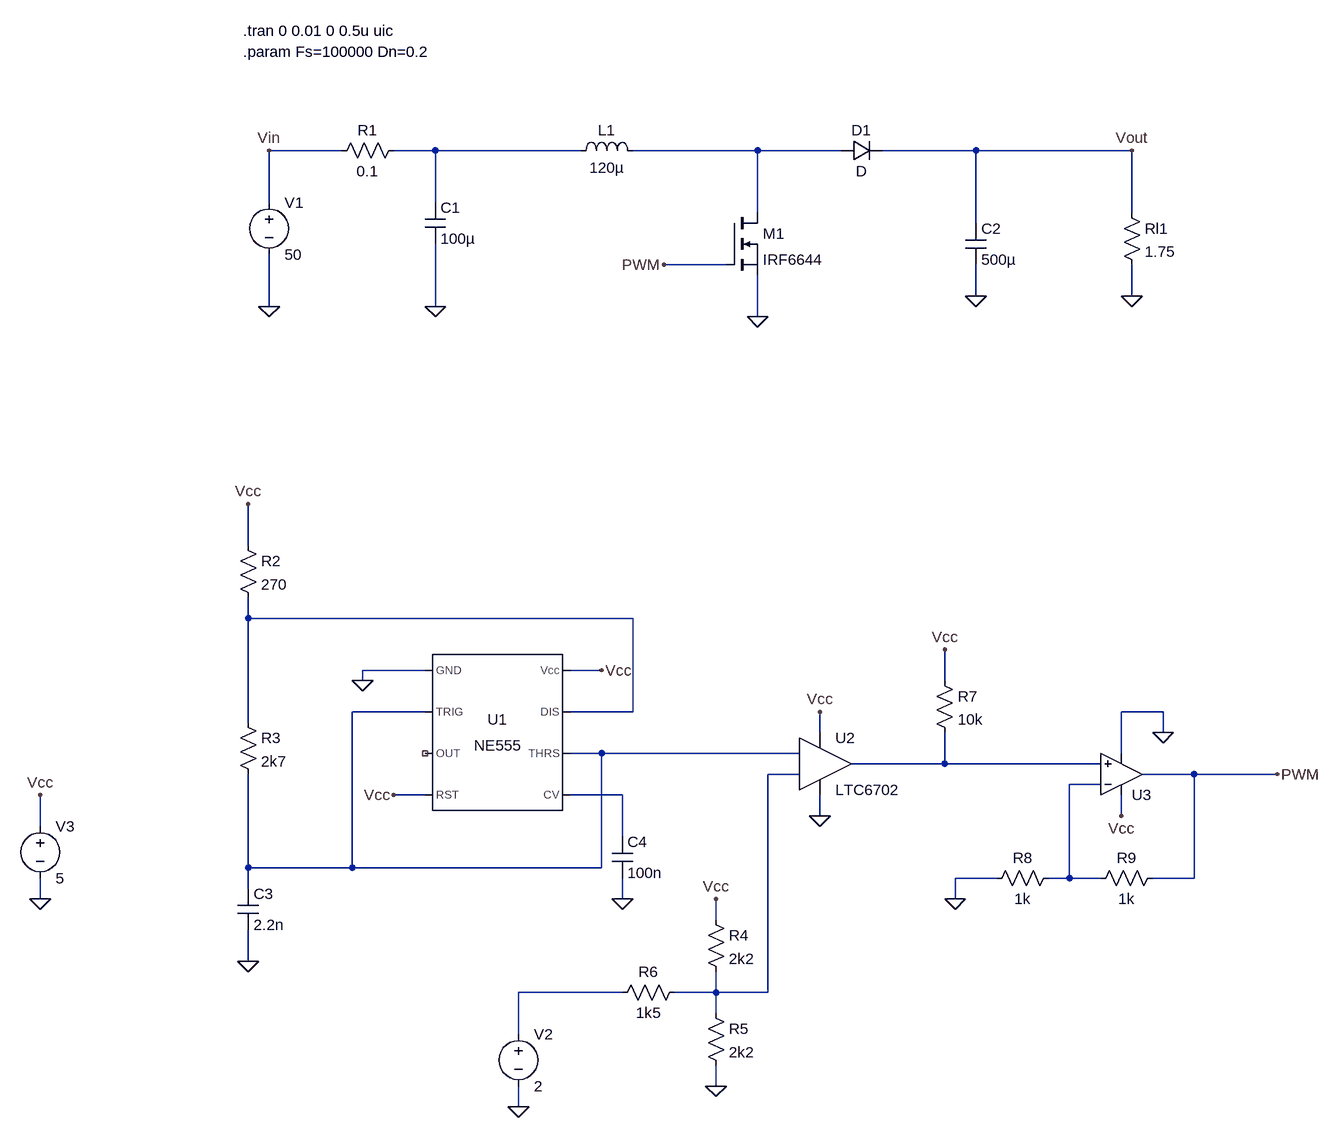
[diagram p0: schematic Completo.asc]
Completo.asc, the LTspice schematic file:
Version 4
SHEET 1 1400 1728
WIRE -304 -80 -416 -80
WIRE -160 -80 -224 -80
WIRE 64 -80 -160 -80
WIRE 336 -80 144 -80
WIRE 464 -80 336 -80
WIRE 672 -80 528 -80
WIRE 912 -80 672 -80
WIRE -416 0 -416 -80
WIRE -160 0 -160 -80
WIRE 336 16 336 -80
WIRE 912 16 912 -80
WIRE 672 32 672 -80
WIRE 288 96 192 96
WIRE 672 144 672 96
WIRE 912 144 912 96
WIRE -416 160 -416 80
WIRE -160 160 -160 64
WIRE 336 176 336 112
WIRE -448 528 -448 464
WIRE -448 640 -448 608
WIRE 144 640 -448 640
WIRE -176 720 -272 720
WIRE 96 720 48 720
WIRE -272 736 -272 720
WIRE 624 736 624 688
WIRE -176 784 -288 784
WIRE 144 784 144 640
WIRE 144 784 48 784
WIRE 960 784 896 784
WIRE -448 800 -448 640
WIRE 432 816 432 784
WIRE 960 816 960 784
WIRE 96 848 48 848
WIRE 400 848 96 848
WIRE 896 848 896 784
WIRE 624 864 624 816
WIRE 624 864 480 864
WIRE 864 864 624 864
WIRE 400 880 352 880
WIRE 1008 880 928 880
WIRE 1136 880 1008 880
WIRE 864 896 816 896
WIRE -176 912 -224 912
WIRE 128 912 48 912
WIRE 432 944 432 912
WIRE 896 944 896 912
WIRE -768 960 -768 912
WIRE 128 976 128 912
WIRE -448 1024 -448 880
WIRE -288 1024 -288 784
WIRE -288 1024 -448 1024
WIRE 96 1024 96 848
WIRE 96 1024 -288 1024
WIRE 704 1040 640 1040
WIRE 816 1040 816 896
WIRE 816 1040 784 1040
WIRE 864 1040 816 1040
WIRE 1008 1040 1008 880
WIRE 1008 1040 944 1040
WIRE -448 1056 -448 1024
WIRE -768 1072 -768 1040
WIRE 128 1072 128 1040
WIRE 640 1072 640 1040
WIRE 272 1104 272 1072
WIRE -448 1168 -448 1120
WIRE 128 1216 -32 1216
WIRE 272 1216 272 1184
WIRE 272 1216 208 1216
WIRE 352 1216 352 880
WIRE 352 1216 272 1216
WIRE 272 1248 272 1216
WIRE -32 1280 -32 1216
WIRE 272 1360 272 1328
WIRE -32 1392 -32 1360
FLAG -416 160 0
FLAG -160 160 0
FLAG 336 176 0
FLAG 672 144 0
FLAG 912 144 0
FLAG 912 -80 Vout
FLAG -416 -80 Vin
FLAG -448 1168 0
FLAG -272 736 0
FLAG 128 1072 0
FLAG -448 464 Vcc
FLAG 96 720 Vcc
FLAG -224 912 Vcc
FLAG 432 944 0
FLAG 432 784 Vcc
FLAG -32 1392 0
FLAG 624 688 Vcc
FLAG 1136 880 PWM
FLAG 272 1360 0
FLAG 272 1072 Vcc
FLAG -768 1072 0
FLAG -768 912 Vcc
FLAG 640 1072 0
FLAG 960 816 0
FLAG 896 944 Vcc
FLAG 192 96 PWM
SYMBOL cap -176 0 R0
SYMATTR InstName C1
SYMATTR Value 100µ
SYMBOL cap 656 32 R0
SYMATTR InstName C2
SYMATTR Value 500µ
SYMBOL ind 48 -64 R270
WINDOW 0 32 56 VTop 2
WINDOW 3 5 56 VBottom 2
SYMATTR InstName L1
SYMATTR Value 120µ
SYMATTR SpiceLine Ipk=67
SYMBOL res 896 0 R0
SYMATTR InstName Rl1
SYMATTR Value 1.75
SYMBOL res -208 -96 R90
WINDOW 0 0 56 VBottom 2
WINDOW 3 32 56 VTop 2
SYMATTR InstName R1
SYMATTR Value 0.1
SYMBOL voltage -416 -16 R0
WINDOW 123 0 0 Left 0
WINDOW 39 0 0 Left 0
SYMATTR InstName V1
SYMATTR Value 50
SYMBOL nmos 288 16 R0
SYMATTR InstName M1
SYMATTR Value IRF6644
SYMBOL diode 464 -64 R270
WINDOW 0 32 32 VTop 2
WINDOW 3 0 32 VBottom 2
SYMATTR InstName D1
SYMBOL Misc\\NE555 -64 816 R0
SYMATTR InstName U1
SYMBOL res -464 512 R0
SYMATTR InstName R2
SYMATTR Value 270
SYMBOL res -464 784 R0
SYMATTR InstName R3
SYMATTR Value 2k7
SYMBOL cap -464 1056 R0
SYMATTR InstName C3
SYMATTR Value 2.2n
SYMBOL cap 112 976 R0
SYMATTR InstName C4
SYMATTR Value 100n
SYMBOL res 256 1088 R0
SYMATTR InstName R4
SYMATTR Value 2k2
SYMBOL res 256 1232 R0
SYMATTR InstName R5
SYMATTR Value 2k2
SYMBOL res 224 1200 R90
WINDOW 0 0 56 VBottom 2
WINDOW 3 32 56 VTop 2
SYMATTR InstName R6
SYMATTR Value 1k5
SYMBOL voltage -32 1264 R0
WINDOW 123 0 0 Left 0
WINDOW 39 0 0 Left 0
SYMATTR InstName V2
SYMATTR Value 2
SYMBOL res 608 720 R0
SYMATTR InstName R7
SYMATTR Value 10k
SYMBOL voltage -768 944 R0
WINDOW 123 0 0 Left 0
WINDOW 39 0 0 Left 0
SYMATTR InstName V3
SYMATTR Value 5
SYMBOL Comparators\\LTC6702 432 864 R0
SYMATTR InstName U2
SYMBOL OpAmps\\UniversalOpAmp 896 880 M180
SYMATTR InstName U3
SYMBOL res 800 1024 R90
WINDOW 0 0 56 VBottom 2
WINDOW 3 32 56 VTop 2
SYMATTR InstName R8
SYMATTR Value 1k
SYMBOL res 960 1024 R90
WINDOW 0 0 56 VBottom 2
WINDOW 3 32 56 VTop 2
SYMATTR InstName R9
SYMATTR Value 1k
TEXT -456 -264 Left 2 !.tran 0 0.01 0 0.5u uic
TEXT -456 -232 Left 2 !.param Fs=100000 Dn=0.2

The netlist it stands for:
* Completo.asc
C1 N001 0 100µ
C2 Vout 0 500µ
L1 N001 N002 120µ Ipk=67
Rl1 Vout 0 1.75
R1 N001 Vin 0.1
V1 Vin 0 50
M1 N002 PWM 0 0 IRF6644
D1 N002 Vout D
XU1 0 N004 NC_01 Vcc N008 N004 N003 Vcc NE555  ; pins GND TRIG OUT RST CV THRS DIS Vcc
R2 Vcc N003 270
R3 N003 N004 2k7
C3 N004 0 2.2n
C4 N008 0 100n
R4 Vcc N006 2k2
R5 N006 0 2k2
R6 N006 N009 1k5
V2 N009 0 2
R7 Vcc N005 10k
V3 Vcc 0 5
XU2 N006 N004 Vcc 0 N005 LTC6702
XU3 N005 N007 Vcc 0 PWM level1 Avol=1Meg GBW=10Meg Vos=0 En=0 Enk=0 In=0 Ink=0 Rin=500Meg  ; pins In+ In- V+ V- OUT
R8 N007 0 1k
R9 PWM N007 1k
.model D D
.lib standard.dio
.model NMOS NMOS
.model PMOS PMOS
.lib standard.mos
.tran 0 0.01 0 0.5u uic
.param Fs=100000 Dn=0.2
.lib NE555.sub
.lib LTC3.lib
.lib UniversalOpAmp1.lib
.backanno
.end